# Altium schematic sheet Sheet2.SchDoc
size A4
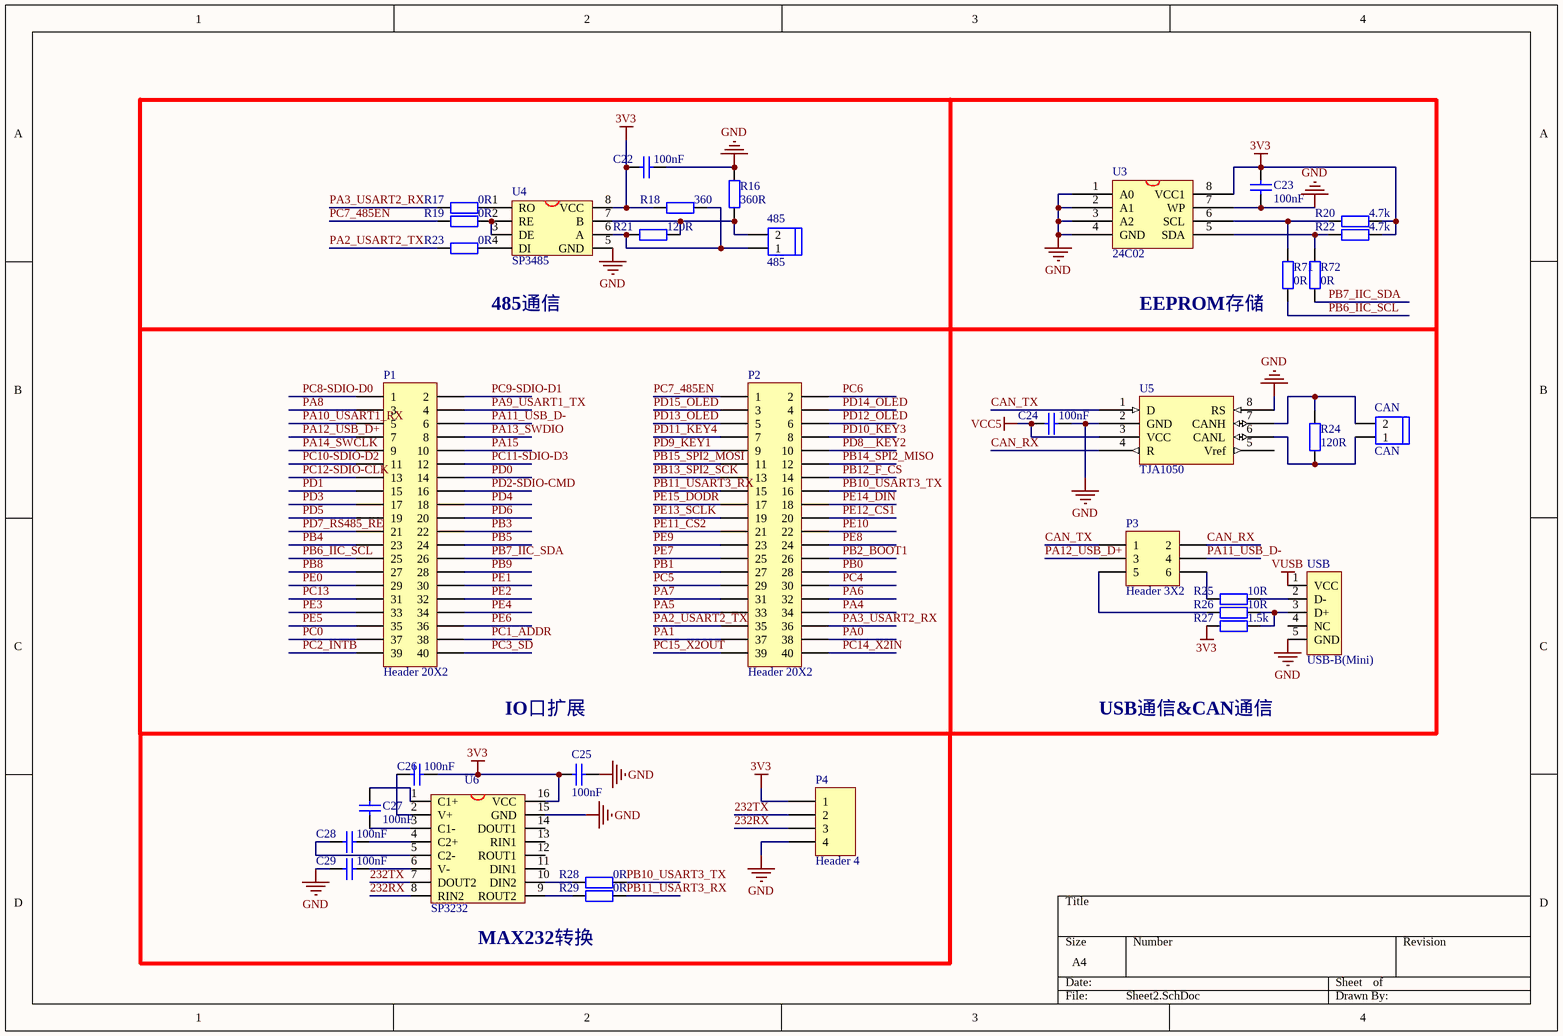
[diagram p0: Sheet2.SchDoc]

## Parts
485  485  [HEAD2L-0.8]
C22  100nF  [LC-0603_C]
C23  100nF  [LC-0603_C]
C24  100nF  [LC-0603_C]
C25  100nF  [LC-0603_C]
C26  100nF  [LC-0603_C]
C27  100nF  [LC-0603_C]
C28  100nF  [LC-0603_C]
C29  100nF  [LC-0603_C]
CAN  CAN  [CON_2_5.08B]
P1  Header 20X2  [HDR2X20]
P2  Header 20X2  [HDR2X20]
P3  Header 3X2  [HDR2X3]
P4  Header 4  [HDR1X4]
R16  360R  [LC-0603_R]
R17  0R  [LC-0603_R]
R18  360  [LC-0603_R]
R19  0R  [LC-0603_R]
R20  4.7k  [LC-0603_R]
R21  120R  [LC-0603_R]
R22  4.7k  [LC-0603_R]
R23  0R  [LC-0603_R]
R24  120R  [LC-0603_R]
R25  10R  [LC-0603_R]
R26  10R  [LC-0603_R]
R27  1.5k  [LC-0603_R]
R28  0R  [LC-0603_R]
R29  0R  [LC-0603_R]
R71  0R  [LC-0603_R]
R72  0R  [LC-0603_R]
U3  24C02  [SO-8]
U4  SP3485  [SO-8]
U5  TJA1050  [SO-8]
U6  SP3232  [SO-16]
USB  USB-B(Mini)  [USB/SM0.8-6H5]

## Nets
3V3: C22.1 C23.1 C25.2 C26.1 P4.1 R18.2 R20.1 R22.1 R27.1 U3.8(VCC1) U4.8(VCC) U6.16(VCC)
GND: C22.2 C23.2 C24.2 C25.1 C29.2 P4.4 R16.1 U3.1(A0) U3.2(A1) U3.3(A2) U3.4(GND) U3.7(WP) U4.5(GND) U5.2(GND) U5.8(RS) U6.15(GND) USB.5(GND)
VCC5: C24.1 U5.3(VCC)
VUSB: USB.1(VCC)
232RX: P4.3 U6.8(RIN2)
232TX: P4.2 U6.7(DOUT2)
CAN_RX: P3.2 U5.4(R)
CAN_TX: P3.1 U5.1(D)
PA0: P2.38
PA1: P2.37
PA2_USART2_TX: P2.35 R23.2
PA3_USART2_RX: P2.36 R17.2
PA4: P2.34
PA5: P2.33
PA6: P2.32
PA7: P2.31
PA8: P1.3
PA9_USART1_TX: P1.4
PA10_USART1_RX: P1.5
PA11_USB_D-: P1.6 P3.4
PA12_USB_D+: P1.7 P3.3
PA13_SWDIO: P1.8
PA14_SWCLK: P1.9
PA15: P1.10
PB0: P2.28
PB1: P2.27
PB2_BOOT1: P2.26
PB3: P1.22
PB4: P1.23
PB5: P1.24
PB6_IIC_SCL: P1.25 R71.1
PB7_IIC_SDA: P1.26 R72.1
PB8: P1.27
PB9: P1.28
PB10_USART3_TX: P2.16 R28.1
PB11_USART3_RX: P2.15 R29.1
PB12_F_CS: P2.14
PB13_SPI2_SCK: P2.13
PB14_SPI2_MISO: P2.12
PB15_SPI2_MOSI: P2.11
PC0: P1.37
PC1_ADDR: P1.38
PC2_INTB: P1.39
PC3_SD: P1.40
PC4: P2.30
PC5: P2.29
PC6: P2.2
PC7_485EN: P2.1 R19.2
PC8-SDIO-D0: P1.1
PC9-SDIO-D1: P1.2
PC10-SDIO-D2: P1.11
PC11-SDIO-D3: P1.12
PC12-SDIO-CLK: P1.13
PC13: P1.31
PC14_X2IN: P2.40
PC15_X2OUT: P2.39
PD0: P1.14
PD1: P1.15
PD2-SDIO-CMD: P1.16
PD3: P1.17
PD4: P1.18
PD5: P1.19
PD6: P1.20
PD7_RS485_RE: P1.21
PD8__KEY2: P2.10
PD9_KEY1: P2.9
PD10_KEY3: P2.8
PD11_KEY4: P2.7
PD12_OLED: P2.6
PD13_OLED: P2.5
PD14_OLED: P2.4
PD15_OLED: P2.3
PE0: P1.29
PE1: P1.30
PE2: P1.32
PE3: P1.33
PE4: P1.34
PE5: P1.35
PE6: P1.36
PE7: P2.25
PE8: P2.24
PE9: P2.23
PE10: P2.22
PE11_CS2: P2.21
PE12_CS1: P2.20
PE13_SCLK: P2.19
PE14_DIN: P2.18
PE15_DODR: P2.17
Net485_1: 485.1 R18.1 R21.2 U4.6(A)
Net485_2: 485.2 R16.2 R21.1 U4.7(B)
NetC26_2: C26.2 U6.2(V+)
NetC27_1: C27.1 U6.3(C1-)
NetC27_2: C27.2 U6.1(C1+)
NetC28_1: C28.1 U6.5(C2-)
NetC28_2: C28.2 U6.4(C2+)
NetC29_1: C29.1 U6.6(V-)
NetCAN_1: CAN.1 R24.2 U5.6(CANL)
NetCAN_2: CAN.2 R24.1 U5.7(CANH)
NetP3_5: P3.5 R26.1
NetP3_6: P3.6 R25.1
NetR17_1: R17.1 U4.1(RO)
NetR19_1: R19.1 U4.2(RE) U4.3(DE)
NetR20_2: R20.2 R71.2 U3.6(SCL)
NetR22_2: R22.2 R72.2 U3.5(SDA)
NetR23_1: R23.1 U4.4(DI)
NetR25_2: R25.2 USB.2(D-)
NetR26_2: R26.2 R27.2 USB.3(D+)
NetR28_2: R28.2 U6.10(DIN2)
NetR29_2: R29.2 U6.9(ROUT2)

Not connected (* = marked no-connect by the designer): U5 5(Vref); U6 11(DIN1) 12(ROUT1) 13(RIN1) 14(DOUT1); USB 4(NC)

## Notes on the sheet
- 485通信
- EEPROM存储
- IO口扩展
- USB通信&CAN通信
- MAX232转换

## Library data of the parts
485 CAN = HEAD2
C22-C29 = Cap: 无极性电容; Published: 8-Jun-2000; LatestRevisionDate: 17-Jul-2002; LatestRevisionNote: Re-released for DXP Platform.; PackageReference: RAD-0.3; Publisher: Altium Limited
P1 P2 = Header 20X2: Header, 20-Pin, Dual row; LatestRevisionDate: 17-Jul-2002; LatestRevisionNote: Re-released for DXP Platform.; Publisher: Altium Limited
P3 = Header 3X2: Header, 3-Pin, Dual row; LatestRevisionDate: 17-Jul-2002; LatestRevisionNote: Re-released for DXP Platform.; Publisher: Altium Limited
P4 = Header 4: Header, 4-Pin; LatestRevisionDate: 17-Jul-2002; LatestRevisionNote: Re-released for DXP Platform.; Publisher: Altium Limited
R16-R29 = Res1: 贴片电阻; Value: 1K; Published: 8-Jun-2000; LatestRevisionDate: 17-Jul-2002; LatestRevisionNote: Re-released for DXP Platform.; PackageReference: AXIAL-0.4; Publisher: Altium Limited
R71 R72 = 0603 1.5KΩ (1501) 1%: 贴片电阻; ComponentLink1Description: 供应商链接; ComponentLink1URL: http://www.szlcsc.com/product/details_23570.html; Package: 0603; Supplier: LC; SuppliersPartNumber: C22843
U3 = 24C256
U4 = MAX3485
U5 = SN65HVD230D
U6 = MAX3232
USB = USB5